# EAGLE design ATF1504JTAG (EAGLE 6.6.0)
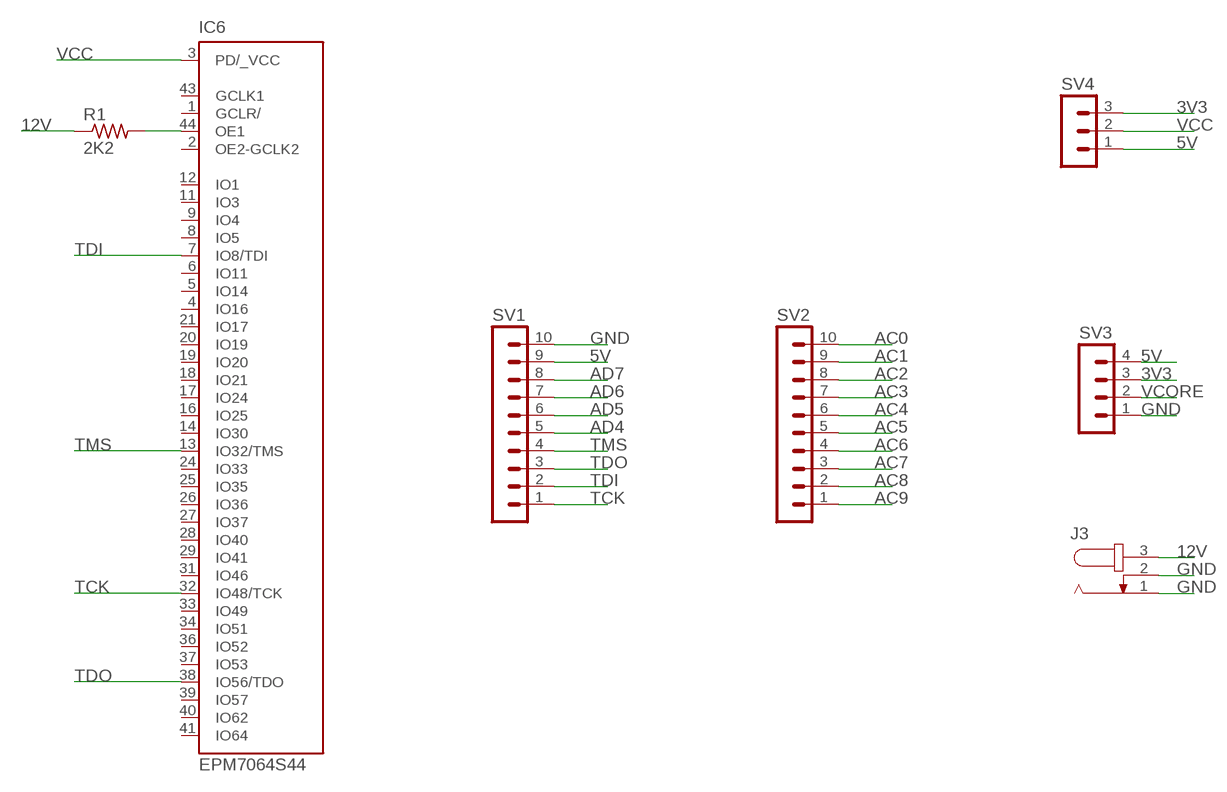
[diagram p0: schematic, sheet 1]

## Parts
IC6  EPM7064S44  [PLCC-S44]
J3  JACK-PLUG1  [SPC4078]
R1  2K2  R-US_0207/10  [0207/10]
SV1  MA10-1  [MA10-1]
SV2  MA10-1  [MA10-1]
SV3  MA04-1  [MA04-1]
SV4  MA03-1  [MA03-1]

## Nets
3V3: SV3.3 SV4.3
5V: SV1.9 SV3.4 SV4.1
12V: J3.3 R1.1
AC0: SV2.10
AC1: SV2.9
AC2: SV2.8
AC3: SV2.7
AC4: SV2.6
AC5: SV2.5
AC6: SV2.4
AC7: SV2.3
AC8: SV2.2
AC9: SV2.1
AD4: SV1.5
AD5: SV1.6
AD6: SV1.7
AD7: SV1.8
GND: J3.1 J3.2 SV1.10 SV3.1
N$1: IC6.44(OE1) R1.2
TCK: IC6.32(IO48/TCK) SV1.1
TDI: IC6.7(IO8/TDI) SV1.2
TDO: IC6.38(IO56/TDO) SV1.3
TMS: IC6.13(IO32/TMS) SV1.4
VCC: IC6.3(PD/_VCC) SV4.2
VCORE: SV3.2
Unconnected: IC6.1(GCLR/) IC6.2(OE2-GCLK2) IC6.4(IO16) IC6.5(IO14) IC6.6(IO11) IC6.8(IO5) IC6.9(IO4) IC6.11(IO3) IC6.12(IO1) IC6.14(IO30) IC6.16(IO25) IC6.17(IO24) IC6.18(IO21) IC6.19(IO20) IC6.20(IO19) IC6.21(IO17) IC6.24(IO33) IC6.25(IO35) IC6.26(IO36) IC6.27(IO37) IC6.28(IO40) IC6.29(IO41) IC6.31(IO46) IC6.33(IO49) IC6.34(IO51) IC6.36(IO52) IC6.37(IO53) IC6.39(IO57) IC6.40(IO62) IC6.41(IO64) IC6.43(GCLK1)

## Power pins joined to a net without a drawn wire
GND: IC6.10(GND) IC6.22(GND) IC6.30(GND) IC6.42(GND)
VCC: IC6.15(VCC) IC6.23(VCC) IC6.35(VCC)

## Library data of the parts
IC6 = altera:EPM7064: EPM7064 MAX 7000 family; MPN: EPM7064SLC44-10N; OC_FARNELL: 1549449; OC_NEWARK: 51R0526
J3 = con-jack:JACK-PLUG: DC POWER JACK Power Jack, DC, Right Angle, Through Hole, Rated 5A at 16VDC, PC Terminals Distributor: Farnell (www.Farnell.de) Drawing: 84N1161.pdf / 84N1162.pdf Manufacturer: SPC Technology (www.spctechnology.com) Type: SPC4077 / SPC 4078; OC_FARNELL: unknown; OC_NEWARK: unknown
R1 = resistor:R-US_: RESISTOR, American symbol
SV1 SV2 = con-lstb:MA10-1: PIN HEADER; OC_FARNELL: unknown; OC_NEWARK: unknown
SV3 = con-lstb:MA04-1: PIN HEADER; OC_FARNELL: unknown; OC_NEWARK: unknown
SV4 = con-lstb:MA03-1: PIN HEADER; OC_FARNELL: unknown; OC_NEWARK: unknown

## Board
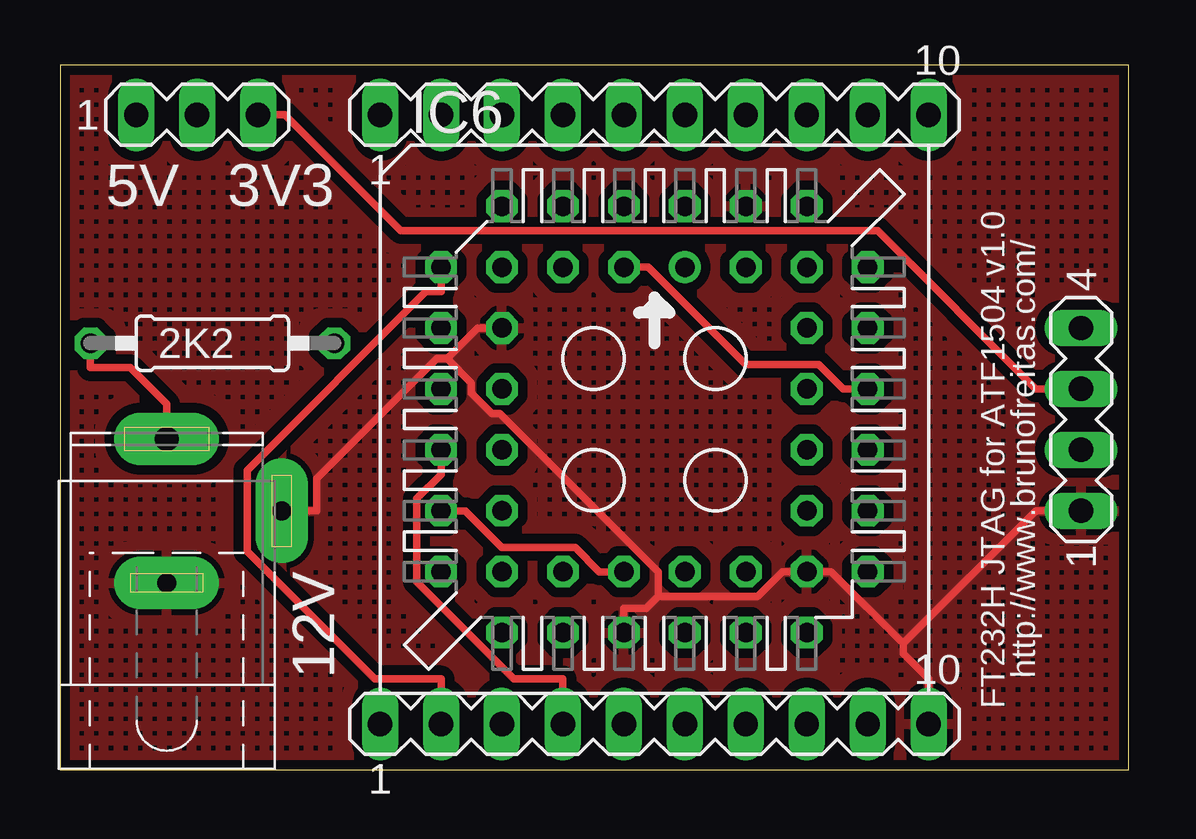
[diagram p1: board, top side]
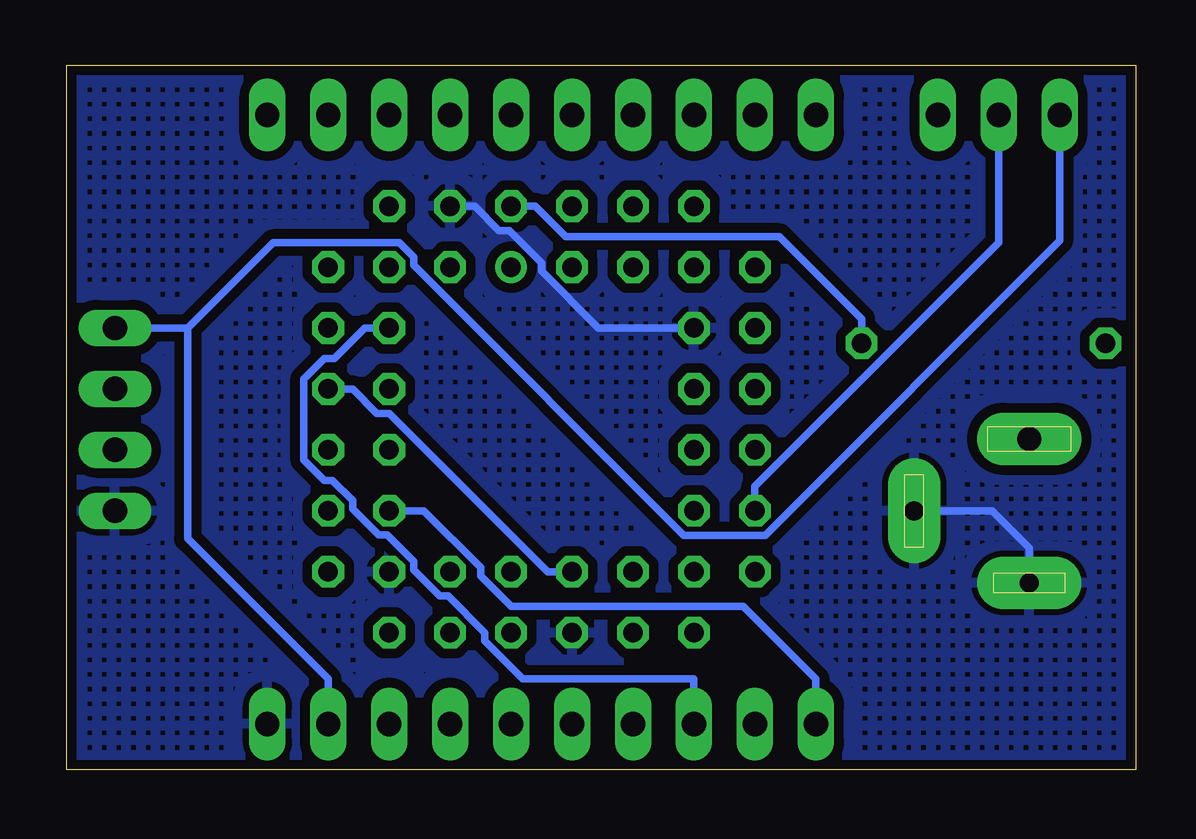
[diagram p2: board, bottom side, seen from below]

Size 44.54 x 29.36 mm. Coordinates in mm from the lower left corner, seen from the top.
Outline: 0,0 44.54,0 44.54,29.36 0,29.36 0,0
Copper layers (1*16): Top 0.035mm / dielectric 1.5mm / Bottom 0.035mm
Design rules "SeeedStudio_2layer_DRU_no_angle_20140221": minimum track width 6mil, minimum drill 12mil, track to track 6mil, track to pad 6mil, pad to pad 6mil, via to via 6mil, smd to smd 0mil, copper to edge 10mil, drill to drill 10mil, minimum pad ring 10mil, minimum via ring 6mil, stop-mask expansion 2mil, vias tented up to drill 100mil, thermal gap 10mil

### Footprints (pad centres in the part's own frame; a part is rotated, then mirrored left to right if it is on the bottom)
PLCC-S44 = drill 0.813: 1 1.27,6.35 | drill 0.813 octagon: 2 -1.27,8.89; 3 -1.27,6.35; 4 -3.81,8.89; 5 -3.81,6.35; 6 -6.35,8.89; 7 -8.89,6.35; 8 -6.35,6.35; 9 -8.89,3.81; 10 -6.35,3.81; 11 -8.89,1.27; 12 -6.35,1.27; 13 -8.89,-1.27; 14 -6.35,-1.27; 15 -8.89,-3.81; 16 -6.35,-3.81; 17 -8.89,-6.35; 18 -6.35,-8.89; 19 -6.35,-6.35; 20 -3.81,-8.89; 21 -3.81,-6.35; 22 -1.27,-8.89; 23 -1.27,-6.35; 24 1.27,-8.89; 25 1.27,-6.35; 26 3.81,-8.89; 27 3.81,-6.35; 28 6.35,-8.89; 29 8.89,-6.35; 30 6.35,-6.35; 31 8.89,-3.81; 32 6.35,-3.81; 33 8.89,-1.27; 34 6.35,-1.27; 35 8.89,1.27; 36 6.35,1.27; 37 8.89,3.81; 38 6.35,3.81; 39 8.89,6.35; 40 6.35,8.89; 41 6.35,6.35; 42 3.81,8.89; 43 3.81,6.35; 44 1.27,8.89
SPC4078 = drill 0.8 pad 2.184 long: 1 -3,0; 2 0,-4.8 | drill 1 pad 2.184 long: 3 3,0
0207/10 = drill 0.813 octagon: 1 -5.08,0; 2 5.08,0
MA10-1 = drill 1.016 long: 1 -11.43,0; 2 -8.89,0; 3 -6.35,0; 4 -3.81,0; 5 -1.27,0; 6 1.27,0; 7 3.81,0; 8 6.35,0; 9 8.89,0; 10 11.43,0
MA04-1 = drill 1.016 long: 1 -3.81,0; 2 -1.27,0; 3 1.27,0; 4 3.81,0
MA03-1 = drill 1.016 long: 1 -2.54,0; 2 0,0; 3 2.54,0

### Placement (x,y rotation side)
IC6  24.77,14.61 0 top
J3  4.45,10.79 90 top
R1  6.35,17.78 0 top
SV1  24.77,1.91 0 top
SV2  24.77,27.3 0 top
SV3  42.55,14.61 90 top
SV4  5.71,27.3 0 top

### Tracks (layer width: path | path; a pad name or v marks a point on that pad's centre or on a via)
3V3
  Top 0.305: SV4.3 9.37,27.3 14.2,22.48 34.06,22.48 40.66,15.88 SV3.3
5V
  Bottom 0.305: 39.51,18.41 39.51,9.64 33.66,3.79 SV1.9 | SV4.1 3.17,22.05 15.45,9.78 18.84,9.78 30.1,21.04 30.1,21.38 30.69,21.97 35.95,21.97 39.51,18.41 | 39.51,18.41 40.66,18.41 SV3.4
12V
  Top 0.305: J3.3 4.45,15.24 2.92,16.76 1.27,16.76 R1.1
GND
  Top 0.305: IC6.22 23.5,6.73 24.43,6.73 24.93,7.23 | 24.93,7.23 24.93,8.26 18.33,14.86 17.99,14.86 17.14,15.7 17.14,16.13 16.13,17.14 | 24.93,7.23 29.08,7.23 30.1,8.26 IC6.30 32.13,8.26 35.13,5.26 | 16.13,17.14 17.4,18.41 IC6.10 | 16.13,17.14 15.7,17.14 10.69,12.14 10.69,10.79 J3.2 | 35.13,5.26 35.13,4.85 36.2,3.79 SV1.10 | 35.13,5.26 40.66,10.79 SV3.1
  Bottom 0.305: IC6.42 27.56,23.5 26.54,22.48 26.12,22.48 24.77,21.12 24.77,20.78 22.4,18.41 IC6.10 | J3.1 4.45,9.24 6,10.79 J3.2
  pour Bottom (isolate 0.406, hatched): 0,29.21 44.45,29.21 44.45,0 0,0
  pour Top (isolate 0.406, hatched): 0,29.21 44.45,29.21 44.45,0 0,0
N$1
  Bottom 0.305: IC6.44 25.02,23.5 23.75,22.23 14.86,22.23 11.43,18.8 R1.2
TCK
  Bottom 0.305: SV1.1 13.34,3.79 16.35,6.8 26.02,6.8 27.3,8.09 27.3,8.43 29.67,10.79 IC6.32
TDI
  Top 0.305: IC6.7 15.88,19.94 15.25,19.94 7.8,12.49 7.8,9.1 13.11,3.79 15.88,3.79 SV1.2
TDO
  Bottom 0.305: IC6.38 32.13,18.41 33.4,17.14 33.82,17.14 34.67,16.29 34.67,12.91 33.83,12.06 33.48,12.06 32.64,11.22 32.64,10.88 31.54,9.78 31.2,9.78 30.1,8.68 30.1,8.34 29,7.24 28.65,7.24 27.12,5.71 27.12,5.37 25.54,3.79 18.41,3.79 SV1.3
TMS
  Top 0.305: IC6.13 15.88,12.32 14.86,11.3 14.86,7.84 18.91,3.79 20.95,3.79 SV1.4
VCC
  Top 0.305: IC6.3 24.51,20.95 28.57,16.89 31.62,16.89 32.64,15.88 IC6.35 | IC6.15 16.89,10.79 18.41,9.27 21.46,9.27 22.48,8.26 IC6.23
  Bottom 0.305: IC6.15 15.88,11.81 5.71,21.97 SV4.2 | IC6.23 24.51,8.26 31.11,14.86 31.62,14.86 32.64,15.88 IC6.35

### Text on the board
tPlace: 5V | 3V3 | 12V | http://www.brunofreitas.com/ | FT232H JTAG for ATF1504 v1.0